# EAGLE design RGB_Station_v11 (EAGLE 7.7.0)
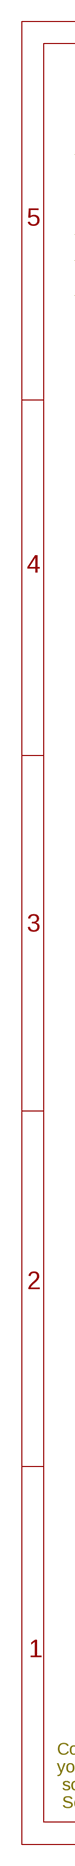
[diagram p0: schematic, sheet 1, part 1 of 2]
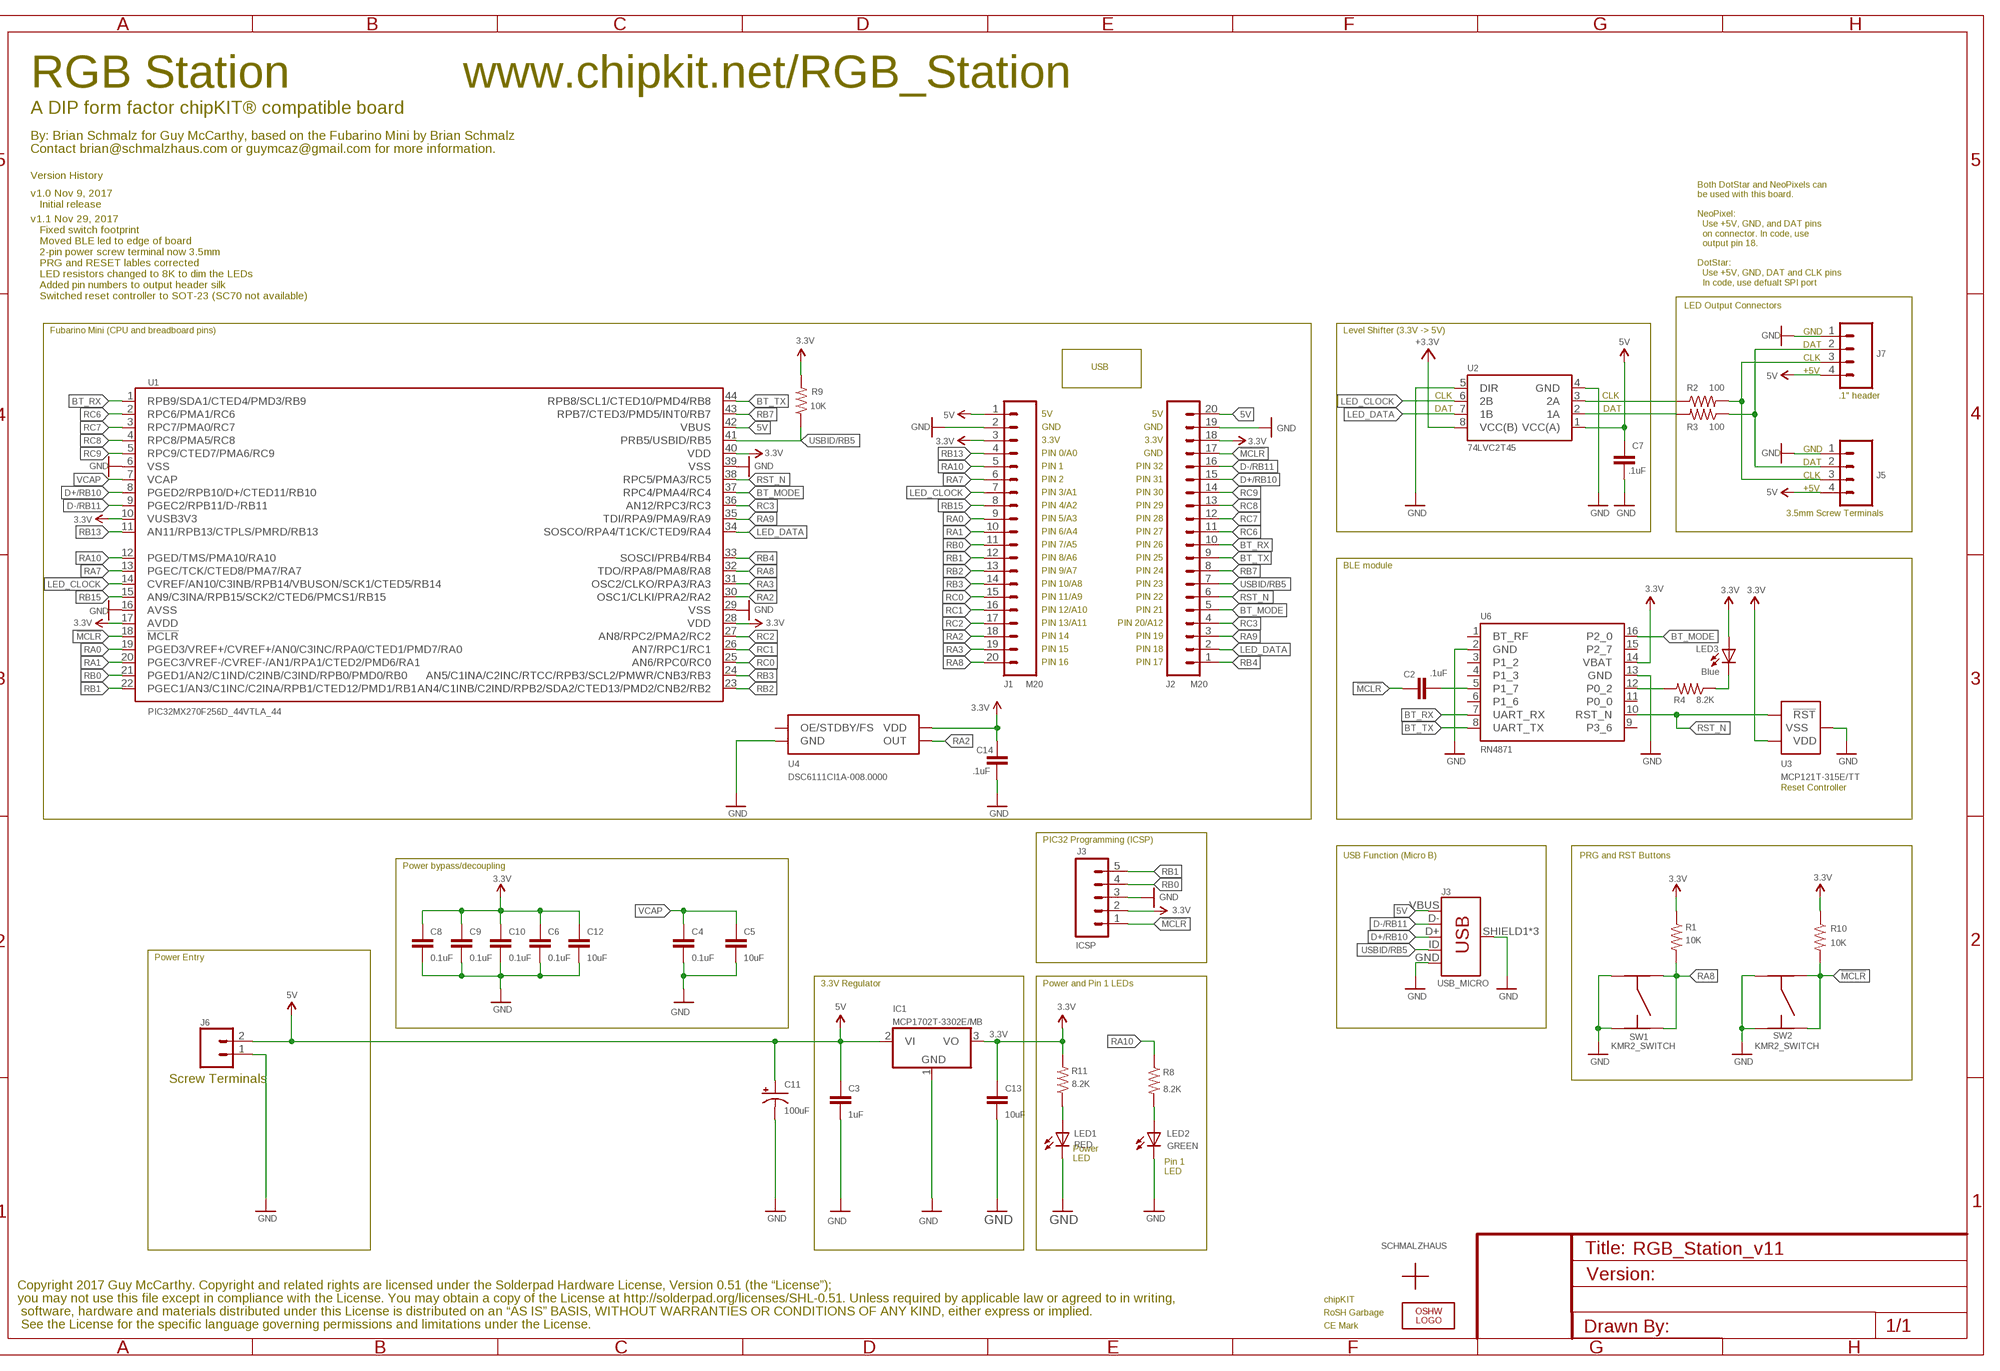
[diagram p1: schematic, sheet 1, part 2 of 2]

## Parts
C2  .1uF  CAP0603-CAP  [0603-CAP]
C3  1uF  CAP0603-CAP  [0603-CAP]
C4  0.1uF  CAP0603-CAP  [0603-CAP]
C5  10uF  CAP0805  [0805]
C6  0.1uF  CAP0603  [0603]
C7  .1uF  CAP0603-CAP  [0603-CAP]
C8  0.1uF  CAP0603-CAP  [0603-CAP]
C9  0.1uF  CAP0603-CAP  [0603-CAP]
C10  0.1uF  CAP0603  [0603]
C11  100uF  CAP_POLC  [PANASONIC_C]
C12  10uF  CAP0805  [0805]
C13  10uF  CAP0805  [0805]
C14  .1uF  CAP0603-CAP  [0603-CAP]
IC1  MCP1702T-3302E/MB  MCP170333MB  [SOT89]
ICSP  J3  M05NOSLILK  [1X05_NOSILK]
J1  M20  [1X20_NO_PIN1]
J2  M20  [1X20_NO_PIN1]
J3  USB_MICRO  USB_MICRO-B_FEMALE-SMT  [USB-B-MICRO-SMD]
J5  CONN_04SCREW  [SCREWTERMINAL-3.5MM-4@1]
J6  CONN_023.5MM  [SCREWTERMINAL-3.5MM-2]
J7  M04PTH  [1X04]
LED1  RED  LED0603  [LED-0603]
LED2  GREEN  LED0603  [LED-0603]
LED3  Blue  LED0603  [LED-0603]
LOGO1  OSHW_LOGO_8MILX0070-NT  [OSHW_8X70_NOTEXT]
R1  10K  RESISTOR0603-RES  [0603-RES]
R2  100  RESISTOR0603  [0603-RES]
R3  100  RESISTOR0603  [0603-RES]
R4  8.2K  RESISTOR0603-RES  [0603-RES]
R8  8.2K  RESISTOR0603-RES  [0603-RES]
R9  10K  RESISTOR0603-RES  [0603-RES]
R10  10K  RESISTOR0603-RES  [0603-RES]
R11  8.2K  RESISTOR0603-RES  [0603-RES]
SW1  KMR2_SWITCH  [KMR2_SWITCH]
SW2  KMR2_SWITCH  [KMR2_SWITCH]
U1  PIC32MX270F256D_44VTLA_44  PIC32MX2XX_44QFN44  [QFN-44-8X8-NOPAD]
U2  74LVC2T45  [VSSOP8]
U3  MCP121T-315E/TT  MCP1X2_RESET_CONTROLLER  [SOT23-3]
U4  DSC6111CI1A-008.0000  DSC61XX  [CDFN-4_3.2X2.5]
U6  RN4871  [RN4871]
U$2  CE_MARK5MM  [CE_5MM]
U$3  ROSH_GARBAGE  [ROHS_GARBAGE_5MM]
U$4  CHIPKIT2MM  [CHIPKIT_2MM]
U$5  SCHMALZHAUSSCHMALZHAUS_SMALL  [SCHMALZHAUS_SMALL]

## Nets
3.3V: C6.1 C8.1 C9.1 C10.1 C12.1 C13.1 C14.2 IC1.3(VO) ICSP.2 J1.3 J2.18 LED3.A R1.1 R9.2 R10.1 R11.2 U1.10(VUSB3V3) U1.17(AVDD) U1.28(VDD) U1.40(VDD) U2.8(VCC(B)) U3.2(VDD) U4.P4(VDD) U6.14(VBAT) ; supply symbol labelled +3.3V
5V: C3.1 C7.2 C11.+ IC1.2(VI) IC1.2@1(VI1) J1.1 J2.20 J3.VBUS J5.4 J6.2 J7.4 U1.42(VBUS) U2.1(VCC(A))
!MCLR!: C2.2 ICSP.1 J2.17 R10.2 SW2.P3 SW2.P4 U1.18(!MCLR!)
BT_MODE: J2.5 U1.37(RPC4/PMA4/RC4) U6.16(P2_0)
BT_RX: J2.10 U1.1(RPB9/SDA1/CTED4/PMD3/RB9) U6.7(UART_RX)
BT_TX: J2.9 U1.44(RPB8/SCL1/CTED10/PMD4/RB8) U6.8(UART_TX)
D+/RB10: J2.15 J3.D+ U1.8(PGED2/RPB10/D+/CTED11/RB10)
D-/RB11: J2.16 J3.D- U1.9(PGEC2/RPB11/D-/RB11)
GND: C3.2 C4.2 C5.2 C6.2 C7.1 C8.2 C9.2 C10.2 C11.- C12.2 C13.2 C14.1 IC1.1(GND) ICSP.3 J1.2 J2.19 J3.GND J3.SHIELD1(SHIELD) J3.SHIELD2(SHIELD) J3.SHIELD3(SHIELD) J5.1 J6.1 J7.1 LED1.C LED2.C SW1.P1 SW1.P2 SW2.P1 SW2.P2 U1.6(VSS) U1.16(AVSS) U1.29(VSS) U1.39(VSS) U2.4(GND) U2.5(DIR) U3.3(VSS) U4.P2(GND) U6.2(GND) U6.13(GND)
LED_CLOCK: J1.7 U1.14(CVREF/AN10/C3INB/RPB14/VBUSON/SCK1/CTED5/RB14) U2.6(2B)
LED_DATA: J2.2 U1.34(SOSCO/RPA4/T1CK/CTED9/RA4) U2.7(1B)
N$1: R4.2 U6.12(P0_2)
N$2: J5.2 J7.2 R3.1
N$3: R3.2 U2.2(1A)
N$4: J5.3 J7.3 R2.2
N$5: LED3.C R4.1
N$6: LED1.A R11.1
N$8: C2.1 U6.5(P1_7)
N$11: LED2.A R8.2
N$23: R2.1 U2.3(2A)
RA0: J1.9 U1.19(PGED3/VREF+/CVREF+/AN0/C3INC/RPA0/CTED1/PMD7/RA0)
RA1: J1.10 U1.20(PGEC3/VREF-/CVREF-/AN1/RPA1/CTED2/PMD6/RA1)
RA2: J1.18 U1.30(OSC1/CLKI/PRA2/RA2) U4.P3(OUT)
RA3: J1.19 U1.31(OSC2/CLKO/RPA3/RA3)
RA7: J1.6 U1.13(PGEC/TCK/CTED8/PMA7/RA7)
RA8: J1.20 R1.2 SW1.P3 SW1.P4 U1.32(TDO/RPA8/PMA8/RA8)
RA9: J2.3 U1.35(TDI/RPA9/PMA9/RA9)
RA10: J1.5 R8.1 U1.12(PGED/TMS/PMA10/RA10)
RB0: ICSP.4 J1.11 U1.21(PGED1/AN2/C1IND/C2INB/C3IND/RPB0/PMD0/RB0)
RB1: ICSP.5 J1.12 U1.22(PGEC1/AN3/C1INC/C2INA/RPB1/CTED12/PMD1/RB1)
RB2: J1.13 U1.23(AN4/C1INB/C2IND/RPB2/SDA2/CTED13/PMD2/CNB2/RB2)
RB3: J1.14 U1.24(AN5/C1INA/C2INC/RTCC/RPB3/SCL2/PMWR/CNB3/RB3)
RB4: J2.1 U1.33(SOSCI/PRB4/RB4)
RB7: J2.8 U1.43(RPB7/CTED3/PMD5/INT0/RB7)
RB13: J1.4 U1.11(AN11/RPB13/CTPLS/PMRD/RB13)
RB15: J1.8 U1.15(AN9/C3INA/RPB15/SCK2/CTED6/PMCS1/RB15)
RC0: J1.15 U1.25(AN6/RPC0/RC0)
RC1: J1.16 U1.26(AN7/RPC1/RC1)
RC2: J1.17 U1.27(AN8/RPC2/PMA2/RC2)
RC3: J2.4 U1.36(AN12/RPC3/RC3)
RC6: J2.11 U1.2(RPC6/PMA1/RC6)
RC7: J2.12 U1.3(RPC7/PMA0/RC7)
RC8: J2.13 U1.4(RPC8/PMA5/RC8)
RC9: J2.14 U1.5(RPC9/CTED7/PMA6/RC9)
RST_N: J2.6 U1.38(RPC5/PMA3/RC5) U3.1(!RST!) U6.10(RST_N)
USBID/RB5: J2.7 J3.ID R9.1 U1.41(PRB5/USBID/RB5)
VCAP: C4.1 C5.1 U1.7(VCAP)
Unconnected: U4.P1(OE/STDBY/FS) U6.1(BT_RF) U6.3(P1_2) U6.4(P1_3) U6.6(P1_6) U6.9(P3_6) U6.11(P0_0) U6.15(P2_7)

## Notes on the sheet
- RGB Station | www.chipkit.net/RGB_Station
- A DIP form factor chipKIT® compatible board
- By: Brian Schmalz for Guy McCarthy, based on the Fubarino Mini by Brian Schmalz
- Contact brian@schmalzhaus.com or guymcaz@gmail.com for more information.
- Version History
- v1.0 Nov 9, 2017
     Initial release
- Both DotStar and NeoPixels can
  be used with this board.
  
  NeoPixel:
    Use +5V, GND, and DAT pins
    on connector. In code, use
    output pin 18.
  
  DotStar:
    Use +5V, GND, DAT and CLK pins
    In code, use defualt SPI port
- v1.1 Nov 29, 2017
     Fixed switch footprint
     Moved BLE led to edge of board
     2-pin power screw terminal now 3.5mm
     PRG and RESET lables corrected
     LED resistors changed to 8K to dim the LEDs
     Added pin numbers to output header silk
     Switched reset controller to SOT-23 (SC70 not available)
- LED Output Connectors
- Fubarino Mini (CPU and breadboard pins) | Level Shifter (3.3V -> 5V) | GND
- DAT
- CLK
- USB
- +5V
- CLK | CLK | .1" header
- 5V | DAT | DAT
- 5V
- GND
- GND
- 3.3V
- 3.3V
- GND | GND
- PIN 0/A0
- PIN 32
- DAT
- PIN 1
- PIN 31
- CLK
- PIN 2
- PIN 30 | +5V
- PIN 3/A1
- PIN 29
- PIN 4/A2
- PIN 28 | 3.5mm Screw Terminals
- PIN 5/A3
- PIN 27
- PIN 6/A4
- PIN 26
- PIN 7/A5
- PIN 25
- PIN 8/A6
- PIN 24 | BLE module
- PIN 9/A7
- PIN 23
- PIN 10/A8
- PIN 22
- PIN 11/A9
- PIN 21
- PIN 12/A10
- PIN 20/A12
- PIN 13/A11
- PIN 19
- PIN 14
- PIN 18
- PIN 15
- PIN 17
- PIN 16
- Reset Controller
- PIC32 Programming (ICSP)
- USB Function (Micro B) | PRG and RST Buttons
- Power bypass/decoupling
- Power Entry
- 3.3V Regulator | Power and Pin 1 LEDs
- Screw Terminals
- Power 
  LED
- Pin 1 
  LED
- Copyright 2017 Guy McCarthy. Copyright and related rights are licensed under the Solderpad Hardware License, Version 0.51 (the “License”);
- you may not use this file except in compliance with the License. You may obtain a copy of the License at http://solderpad.org/licenses/SHL-0.51. Unless required by applicable law or agreed to in writing,
- software, hardware and materials distributed under this License is distributed on an “AS IS” BASIS, WITHOUT WARRANTIES OR CONDITIONS OF ANY KIND, either express or implied.
- See the License for the specific language governing permissions and limitations under the License.

## Library data of the parts
C2 C7 = SparkFun-Capacitors:CAP: Capacitor Standard 0603 ceramic capacitor, and 0.1" leaded capacitor.
C3 C4 C8 C9 C14 = SparkFun:CAP: Capacitor Standard 0603 ceramic capacitor, and 0.1" leaded capacitor.
C5 C12 = SchmalzHaus:CAP: Capacitor Standard 0603 ceramic capacitor, and 0.1" leaded capacitor.
C6 C10 C13 = SparkFun02-20-08:CAP: Capacitor Standard 0603 ceramic capacitor, and 0.1" leaded capacitor.
C11 = SparkFun-Capacitors:CAP_POL: Capacitor Polarized These are standard SMD and PTH capacitors. Normally 10uF, 47uF, and 100uF in electrolytic and tantalum varieties. Always verify the external diameter of the through hole cap, it varies with capacity, voltage, and manufacturer. The EIA devices should be standard.
IC1 = linear:MCP1703*: 250 mA, 16V, Low Quiescent Current LDO Regulator Source: http://ww1.microchip.com/downloads/en/DeviceDoc/22049b.pdf
ICSP = SchmalzHaus:M05: Header 5 Standard 5-pin 0.1" header. Use with straight break away headers (SKU : PRT-00116), right angle break away headers (PRT-00553), swiss pins (PRT-00743), machine pins (PRT-00117), and female headers (PRT-00115). Molex polarized connector foot print use with SKU : PRT-08230 with associated crimp pins and housings.
J1 J2 = SchmalzHaus:M20
J3 = SparkFun-Connectors:USB_MICRO-B: USB Type Micro-B Connector Male/female and PTH/SMT variants SparkFun Products: SparkFun microB USB Breakout <https://www.sparkfun.com/products/12035> SparkFun USB microB Plug Breakout <https://www.sparkfun.com/products/10031> SparkFun ESP8266 Thing <https://www.sparkfun.com/products/13231>; PROD_ID: CONN-11752
J5 = SparkFun-Connectors:CONN_04: Multi connection point. Often used as Generic Header-pin footprint for 0.1 inch spaced/style header connections On any of the 0.1 inch spaced packages, you can populate with these: Break Away Headers - Straight <https://www.sparkfun.com/products/116> (PRT-00116) Break Away Male Headers - Right Angle <https://www.sparkfun.com/products/553> (PRT-00553) Female Headers <https://www.sparkfun.com/products/115> (PRT-00115) Break Away Headers - Machine Pin <https://www.sparkfun.com/products/117> (PRT-00117) Break Away Female Headers - Swiss Machine Pin <https://www.sparkfun.com/products/743> (PRT-00743) For SCREWTERMINALS and SPRING TERMINALS visit here: Screw Terimnals on SparkFun.com <https://www.sparkfun.com/search/results?term=Screw+Terminals> (5mm/3.5mm/2.54mm spacing) This device is also useful as a general connection point to wire up your design to another part of your project. Our various solder wires solder well into these plated through hole pads. Hook-Up Wire - Assortment (Stranded, 22 AWG) <https://www.sparkfun.com/products/11375> (PRT-11375) Hook-Up Wire - Assortment (Solid Core, 22 AWG) <https://www.sparkfun.com/products/11367> (PRT-11367) View the entire wire category on our website here <https://www.sparkfun.com/categories/141> Special notes: Molex polarized connector foot print use with SKU : PRT-08231 with associated crimp pins and housings. 1MM SMD Version SKU: PRT-10208; PROD_ID: 2xCONN-08399; SF_ID: 2xPRT-08084
J6 = SparkFun-Connectors:CONN_02: Multi connection point. Often used as Generic Header-pin footprint for 0.1 inch spaced/style header connections On any of the 0.1 inch spaced packages, you can populate with these: Break Away Headers - Straight <https://www.sparkfun.com/products/116> (PRT-00116) Break Away Male Headers - Right Angle <https://www.sparkfun.com/products/553> (PRT-00553) Female Headers <https://www.sparkfun.com/products/115> (PRT-00115) Break Away Headers - Machine Pin <https://www.sparkfun.com/products/117> (PRT-00117) Break Away Female Headers - Swiss Machine Pin <https://www.sparkfun.com/products/743> (PRT-00743) For SCREWTERMINALS and SPRING TERMINALS visit here: Screw Terimnals on SparkFun.com <https://www.sparkfun.com/search/results?term=Screw+Terminals> (5mm/3.5mm/2.54mm spacing) This device is also useful as a general connection point to wire up your design to another part of your project. Our various solder wires solder well into these plated through hole pads. Hook-Up Wire - Assortment (Stranded, 22 AWG) <https://www.sparkfun.com/products/11375> (PRT-11375) Hook-Up Wire - Assortment (Solid Core, 22 AWG) <https://www.sparkfun.com/products/11367> (PRT-11367) View the entire wire category on our website here <https://www.sparkfun.com/categories/141> Special notes: Molex polarized connector foot print use with: PRT-08233 with associated crimp pins and housings. 2.54_SCREWTERM for use with PRT-10571. 3.5mm Screw Terminal footprints for PRT-08084 5mm Screw Terminal footprints for use with PRT-08432; PROD_ID: CONN-08399
J7 = SparkFun-Connectors:M04: Header 4 Standard 4-pin 0.1" header. Use with straight break away headers (SKU : PRT-00116), right angle break away headers (PRT-00553), swiss pins (PRT-00743), machine pins (PRT-00117), and female headers (PRT-00115). Molex polarized connector foot print use with SKU : PRT-08231 with associated crimp pins and housings. 1MM SMD Version SKU: PRT-10208; PROD_ID: CONN-09696
LED1-LED3 = SparkFun:LED: LEDs Standard schematic elements and footprints for 5mm, 3mm, 1206, and 0603 sized LEDs. 5mm - Spark Fun Electronics SKU : COM-00529 (and others)
LOGO1 = OSHW:OSHW_LOGO_8MIL
R1 R4 R8-R11 = SparkFun:RESISTOR: Resistor Basic schematic elements and footprints for 0603, 1206, and PTH resistors.
R2 R3 = SparkFun-Resistors:RESISTOR: Resistor Basic schematic elements and footprints for 0603, 1206, and PTH resistors.
SW1 SW2 = kmr2_switch:KMR2_SWITCH
U1 = SchmalzHaus:PIC32MX2XX_44
U2 = 74LVCH2T45DC:74LVC2T45
U3 = MCP1x2_ResetController:MCP1X2_RESET_CONTROLLER
U4 = DSC61XX:DSC61XX
U6 = RN4870-71:RN4871
U$2 = SchmalzHausPublic:CE_MARK
U$3 = SchmalzHausPublic:ROSH_GARBAGE
U$4 = SchmalzHausPublic:CHIPKIT
U$5 = SchmalzHaus:SCHMALZHAUS

## Board
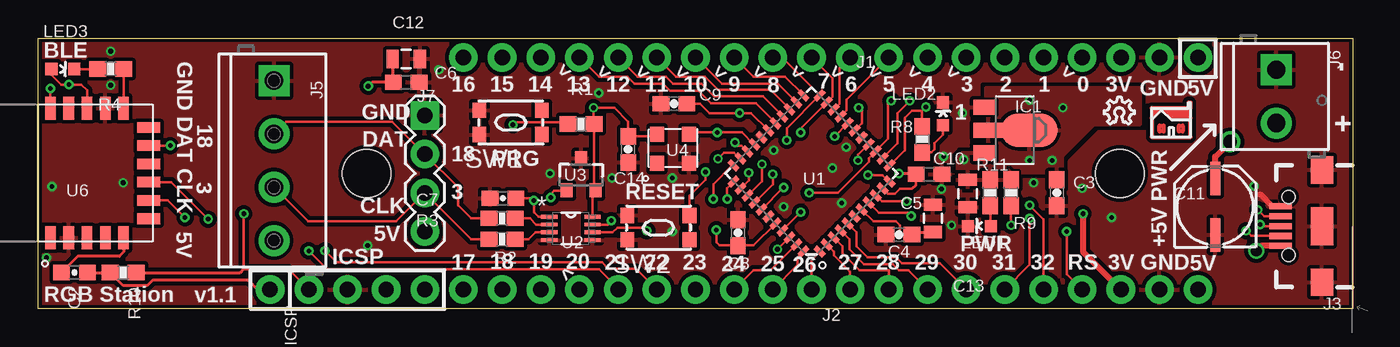
[diagram p2: board, top side]
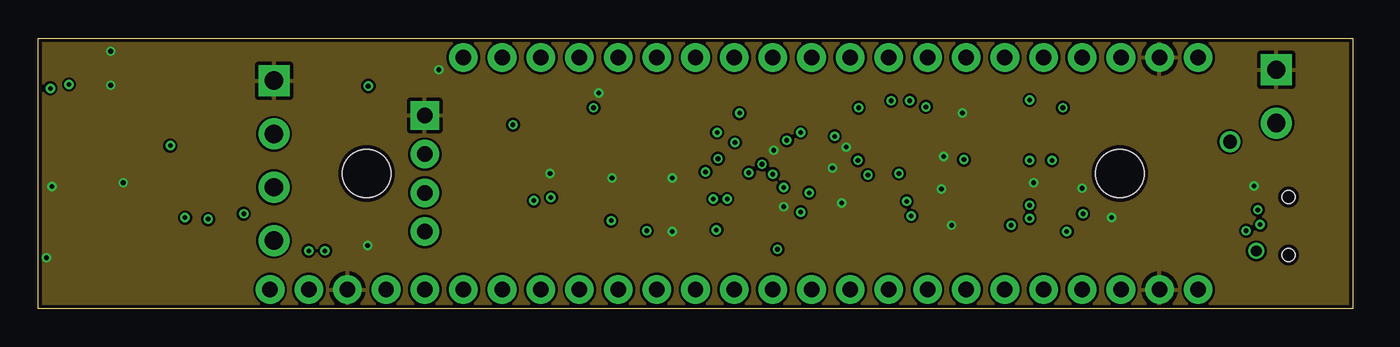
[diagram p3: board, inner layer Route2]
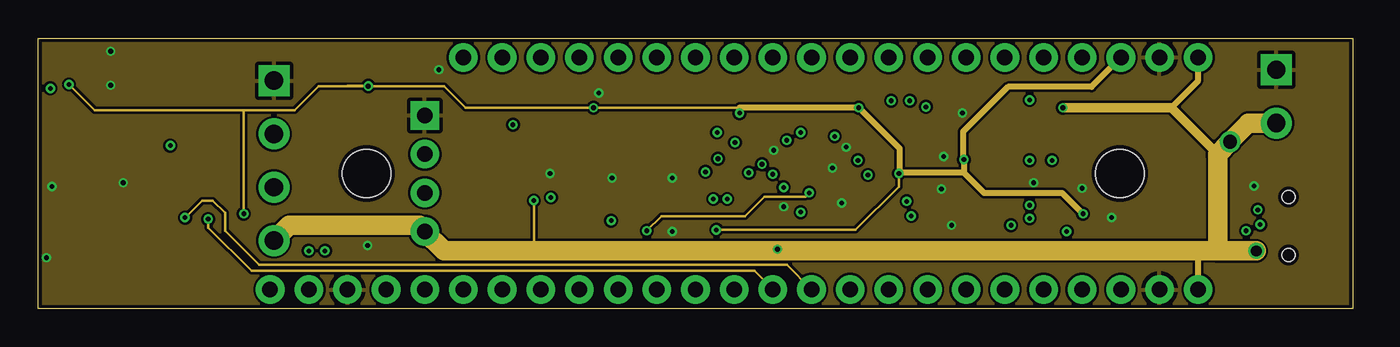
[diagram p4: board, inner layer Route15]
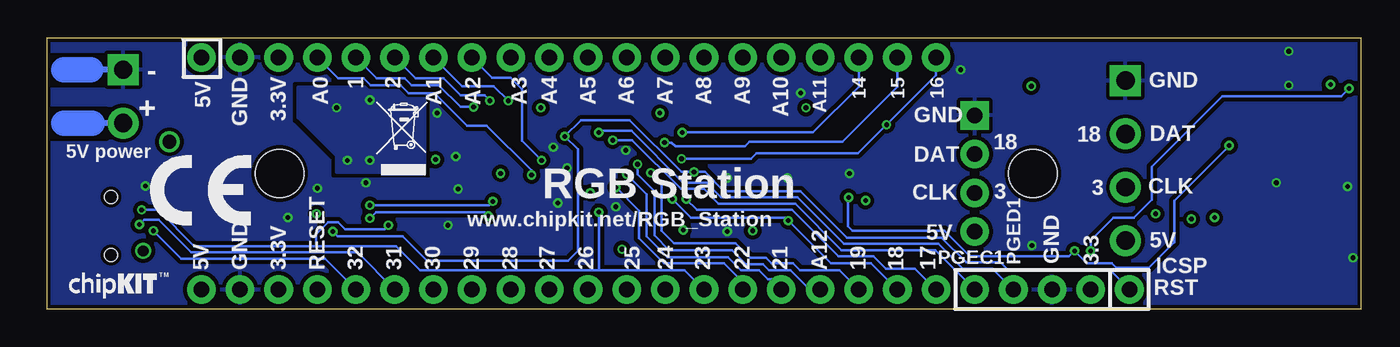
[diagram p5: board, bottom side, seen from below]

Size 86.36 x 17.78 mm. Coordinates in mm from the lower left corner, seen from the top.
Outline: 0,17.78 86.36,17.78 86.36,0 0,0 0,17.78
Copper layers (1*2*15*16): Top 0.035mm / dielectric 1.5mm / Route2 0.035mm / dielectric 0.15mm / Route15 0.035mm / dielectric 0.2mm / Bottom 0.035mm
Design rules "Fusion_eagle_rule_v1.1 *": minimum track width 6mil, minimum drill 12mil, track to track 6mil, track to pad 6mil, pad to pad 6mil, via to via 6mil, smd to smd 0mil, copper to edge 10mil, drill to drill 10mil, minimum pad ring 10mil, minimum via ring 6mil, stop-mask expansion 2mil, vias tented up to drill 100mil, thermal gap 10mil
Holes 3.17 mm at 21.59,8.89 71.04,8.89
bRestrict: area 82.4,11.3 to 86.4,13.1; area 82.5,14.8 to 86.5,16.6

### Footprints (pad centres in the part's own frame; a part is rotated, then mirrored left to right if it is on the bottom)
0603-CAP = smd 1.1 x 1: 1 -0.85,0; 2 0.85,0
0805 = smd 0.8 x 1.2: 1 -0.9,0; 2 0.9,0
0603 = smd 1.1 x 1: 1 -0.85,0; 2 0.85,0
PANASONIC_C = smd 2.2 x 0.65: + 1.9,-0.2; - -1.8,-0.2
SOT89 = smd 1 x 1.5: 1 -1.499,-1.981; 3 1.499,-1.981 | smd 1 x 2: 2 0,-1.727 | smd 2.2 x 3.7: 2@1 0,0.94
1X05_NOSILK = drill 1.016 pad 1.88: 1 0,0; 2 2.54,0; 3 5.08,0; 4 7.62,0; 5 10.16,0
1X20_NO_PIN1 = drill 1.016 pad 1.88: 1 -24.13,0; 2 -21.59,0; 3 -19.05,0; 4 -16.51,0; 5 -13.97,0; 6 -11.43,0; 7 -8.89,0; 8 -6.35,0; 9 -3.81,0; 10 -1.27,0; 11 1.27,0; 12 3.81,0; 13 6.35,0; 14 8.89,0; 15 11.43,0; 16 13.97,0; 17 16.51,0; 18 19.05,0; 19 21.59,0; 20 24.13,0
USB-B-MICRO-SMD = smd 1.45 x 0.4: D+ 2.725,0; D- 2.725,0.65; GND 2.725,-1.3; ID 2.725,-0.65; VBUS 2.725,1.3 | smd 1.5 x 1.8: SHIELD1 0,3.685; SHIELD2 0,-3.685 | smd 1.5 x 2.5: SHIELD3 0,0 | hole 0.85: 2.2,1.9; 2.2,-1.9
SCREWTERMINAL-3.5MM-4@1 = drill 1.2 pad 2.032 square: 1 0,0 | drill 1.2 pad 2.032: 2 3.5,0; 3 7,0; 4 10.5,0
SCREWTERMINAL-3.5MM-2 = drill 1.2 pad 2.032 square: 1 0,0 | drill 1.2 pad 2.032: 2 3.5,0
1X04 = drill 1.016 pad 1.88 square: 1 0,0 | drill 1.016 pad 1.88: 2 2.54,0; 3 5.08,0; 4 7.62,0
LED-0603 = smd 0.8 x 0.8: A 0,-0.75; C 0,0.75
0603-RES = smd 1.1 x 1: 1 -0.85,0; 2 0.85,0
KMR2_SWITCH = smd 0.9 x 1: P1 -2.05,0.8; P2 -2.05,-0.8; P3 2.05,-0.8; P4 2.05,0.8
QFN-44-8X8-NOPAD = smd 0.8 x 0.35: 1 -4,3.25; 2 -4,2.6; 3 -4,1.95; 4 -4,1.3; 5 -4,0.65; 6 -4,0; 7 -4,-0.65; 8 -4,-1.3; 9 -4,-1.95; 10 -4,-2.6; 11 -4,-3.25; 23 4,-3.25; 24 4,-2.6; 25 4,-1.95; 26 4,-1.3; 27 4,-0.65; 28 4,0; 29 4,0.65; 30 4,1.3; 31 4,1.95; 32 4,2.6; 33 4,3.25 | smd 0.35 x 0.8: 12 -3.25,-4; 13 -2.6,-4; 14 -1.95,-4; 15 -1.3,-4; 16 -0.65,-4; 17 0,-4; 18 0.65,-4; 19 1.3,-4; 20 1.95,-4; 21 2.6,-4; 22 3.25,-4; 34 3.25,4; 35 2.6,4; 36 1.95,4; 37 1.3,4; 38 0.65,4; 39 0,4; 40 -0.65,4; 41 -1.3,4; 42 -1.95,4; 43 -2.6,4; 44 -3.25,4
VSSOP8 = smd 1.067 x 0.254: 1 -1.422,0.762; 2 -1.422,0.254; 3 -1.422,-0.254; 4 -1.422,-0.762; 5 1.422,-0.762; 6 1.422,-0.254; 7 1.422,0.254; 8 1.422,0.762
SOT23-3 = smd 0.8 x 0.9: 1 -0.95,-1; 2 0.95,-1; 3 0,1.1
CDFN-4_3.2X2.5 = smd 1 x 0.9: P1 -0.95,1.05; P2 -0.95,-1.05; P3 0.95,-1.05; P4 0.95,1.05
RN4871 = smd 1.5 x 0.7: 1 0.25,6.7; 2 0.25,5.5; 3 0.25,4.3; 4 0.25,3.1; 5 0.25,1.9; 12 8.75,1.9; 13 8.75,3.1; 14 8.75,4.3; 15 8.75,5.5; 16 8.75,6.7 | smd 0.7 x 1.5: 6 1.5,0.25; 7 2.7,0.25; 8 3.9,0.25; 9 5.1,0.25; 10 6.3,0.25; 11 7.5,0.25

### Placement (x,y rotation side)
C2  2.39,2.39 0 top
C3  66.9,7.62 270 top
C4  56.54,4.88 180 top
C5  58.78,5.94 90 top
C6  24.18,14.88 0 top
C7  30.53,7.26 0 top
C8  45.97,5 90 top
C9  41.76,13.46 180 top
C10  58.52,8.84 0 top
C11  77.11,6.65 90 top
C12  24.18,16.41 0 top
C13  61.06,7.57 270 top
C14  38.76,10.46 90 top
IC1  64.16,11.73 270 top
ICSP  15.24,1.27 0 top
J1  52.07,16.51 180 top
J2  52.07,1.27 0 top
J3  84.33,5.44 180 top
J5  15.49,14.99 270 top
J6  81.33,15.7 270 top
J7  25.4,12.7 270 top
LED1  61.82,5.44 90 top
LED2  59.44,12.8 0 top
LED3  1.63,15.75 270 top
LOGO1  70.03,12.14 0 top
R1  35.66,12.14 180 top
R2  30.48,4.57 180 top
R3  30.48,5.94 0 top
R4  4.78,15.75 0 top
R8  58.06,11.13 270 top
R9  63.91,7.62 90 top
R10  5.59,2.39 180 top
R11  62.53,7.62 90 top
SW1  31.04,12.24 0 top
SW2  40.74,5.33 0 top
U1  50.8,8.89 135 top
U2  35,5.28 0 top
U3  35.66,8.79 0 top
U4  41.71,10.52 90 top
U6  7.52,4.42 90 top
U$2  76.23,7.83 0 bottom
U$3  64.67,8.78 0 bottom
U$4  84.99,0.65 0 bottom
U$5  74.42,11.28 0 top

### Tracks (layer width: path | path; a pad name or v marks a point on that pad's centre or on a via)
3.3V  (via drill 0.3, 0.33)
  Top 0.178: 55.5,7.9 55.83,7.57 56.29,7.57 56.59,7.87 57.4,7.87 57.66,8.13 57.66,8.83 C10.1 | U1.28 46.84,12.85 v46.08,12.85 44.09,12.85 43.48,13.46 C9.1 | U1.17 54.1,12.19 54.1,13.01 v53.9,13.21 | U1.40 46.99,4.17 45.98,4.17 | 45.98,4.17 C8.1 | 45.98,4.17 44.76,4.17 44.55,4.37 v44.55,5.18 | ICSP.2 16.46,2.59 13.56,2.59 13.51,2.64 v13.51,6.25 | U2.8 36.42,7.52 36.52,7.52 36.61,7.61 U3.2 36.52,7.88 36.52,12.13 R1.1 36.48,12.17 v36.48,13.21 37.85,13.21 38.76,12.29 C14.2 38.95,11.31 38.96,11.33 40.52,11.33 U4.P4 | U6.14 3.22,14.36 2.85,14.73 v2.03,14.73 1.52,14.73 0.88,15.38 LED3.A
  Top 0.203: U1.10 55.5,7.9 | U1.40 | v56.54,8.89 57.62,8.89 C10.1 | R10.1 13.26,2.39 13.51,2.64 | C12.1 23.28,14.93 C6.1 21.95,14.88 v21.69,14.63
  Top 0.406: v68.63,6.25 68.63,3.76 J2.18
  Route15 0.178: 46.08,13.21 v36.48,13.21 28.09,13.21 26.67,14.63 v21.69,14.63 | 20.32,14.63 18.44,14.63 16.87,13.06 13.5,13.06 | 13.5,13.06 3.71,13.06 v2.03,14.73 | 13.5,13.06 13.5,6.26 v13.51,6.25 | v44.55,5.18 53.7,5.18 56.54,8.03 v56.54,8.89
  Route15 0.203: v21.69,14.63 20.32,14.63
  Route15 0.406: J1.3 69.19,14.58 63.7,14.58 60.76,11.63 60.76,9.86 v60.81,9.8 60.81,8.94 | 60.81,8.94 62.13,7.62 67.26,7.62 v68.63,6.25 | 60.81,8.94 56.59,8.94 | 56.59,8.94 v56.54,8.89 | 56.59,8.94 56.59,10.52 v53.9,13.21 46.08,13.21 v46.08,12.85
  pour Top: 60.71,10.26 60.35,9.91 60.35,7.98 63.96,7.98 63.96,8.94 63.6,9.3 62.79,9.3 62.53,9.55 62.53,9.86 62.13,10.26
5V  (via drill 0.3, 0.7, 0.9)
  Top 0.178: C7.2 32.41,7.26 v32.56,7.11 32.56,6.35 32.87,6.04 U2.1 | 49.35,4.7 v48.56,3.91
  Top 0.203: U1.42 49.35,4.7
  Top 0.406: C11.+ 77.31,10 v78.28,10.97 | J3.VBUS 80.34,4.14 v80.01,3.81
  Route15 0.178: v32.56,7.11 32.56,3.86 32.51,3.81 | v48.56,3.91 48.56,3.81
  Route15 0.254: 79.5,12.19 79.51,12.19
  Route15 0.406: 74.42,13.21 76.2,14.99 J1.1 | J2.20 76.2,3.81 | 77.47,10.06 77.47,10.16
  Route15 0.61: 77.47,10.16 74.42,13.21 v67.31,13.21
  Route15 1.27: 77.47,10.06 77.47,3.81 | 77.47,3.81 76.2,3.81 48.56,3.81 32.51,3.81 26.67,3.81 J7.4 25.4,5.13 25.04,5.49 16.49,5.49 J5.4 | 77.47,3.81 v80.01,3.81 | 77.47,10.16 v78.28,10.97 79.5,12.19 79.51,12.2 J6.2
  Bottom 0.406: J6.2 83.36,12.19
  Bottom 1.676: 83.36,12.19 85.24,12.19
  other vias: 66.6,9.75 65.13,13.72 65.13,9.75
  pour Top (rank 3): 62.28,8.94 67.31,8.94 67.31,10.01 69.39,12.09 72.39,12.09 72.44,12.14 72.44,14.53 62.23,14.53
  pour Bottom: 61.52,14.58 61.52,8.89 67.31,8.94 67.31,10.01 69.85,12.55 69.85,14.58
!MCLR!  (via drill 0.3)
  Top 0.178: v52.32,11.33 U1.18 | v67.56,5.08 67.56,2.29 J2.17 | v43.84,8.99 43.84,8.48 42.79,7.43 SW2.P4 SW2.P3
  Top 0.203: v52.32,11.33 | C2.2 R10.2 5.6,1.52 7.16,1.52 7.52,1.88 13.82,1.88 14.43,1.27 ICSP.1
  Bottom 0.178: v67.56,5.08 67.26,4.78 62.99,4.78 61.37,3.15 52.12,3.15 51.46,3.81 51.46,10.46 v52.32,11.33 51.26,12.39 48.06,12.39 44.65,8.99 v43.84,8.99 43.13,8.99 41.86,7.72 36.83,7.72 33.78,4.67 27.58,4.67 25.96,3.05 23.72,3.05 23.27,2.59 16.56,2.59 ICSP.1
BT_MODE  (via drill 0.3)
  Top 0.178: v48.26,8.84 48.26,8.18 47.06,6.98 | J2.5 38.1,1.32 36.83,2.59 19,2.59 v17.78,3.81 | v0.81,14.48 U6.16
  Top 0.203: U1.37 47.06,6.98
  Bottom 0.178: J2.5 38.76,1.93 38.96,1.93 39.57,2.54 40.74,2.54 41.6,3.4 45.57,3.4 46.94,4.78 46.94,7.52 v48.26,8.84 | v17.78,3.81 17.78,4.52 16.31,5.99 14.94,5.99 13.77,7.16 13.77,9.35 9.14,13.97 1.32,13.97 v0.81,14.48
BT_RX  (via drill 0.3)
  Top 0.178: 51.35,3.75 51.33,3.73 | 51.33,3.73 50.8,3.2 J2.10 | U6.7 8.53,7.12 v9.65,5.99 | U1.1 51.33,3.73
  Top 0.203: 51.35,3.76 51.35,3.75
  Route15 0.178: J2.10 49.17,2.9 14.53,2.9 12.29,5.13 12.29,6.3 11.48,7.11 10.77,7.11 v9.65,5.99
BT_TX  (via drill 0.3)
  Top 0.178: 50.16,3.68 49.89,3.4 49.89,2.9 J2.9 | U6.8 8.75,8.32 v11.18,5.89 | 50.27,3.68 U1.44
  Top 0.203: 50.27,3.68 50.16,3.68
  Route15 0.178: J2.9 47.04,2.49 14.02,2.49 11.18,5.33 v11.18,5.89
D+/RB10  (via drill 0.3)
  Top 0.178: U1.8 55.22,6.3 57.15,6.3 v57.35,6.1 | J3.D+ 80.37,5.44 v80.26,5.54 | v65.13,5.94 65.13,2.9 J2.15
  Top 0.203: U1.8
  Bottom 0.178: v57.35,6.1 57.61,6.35 64.72,6.35 v65.13,5.94 | v80.26,5.54 79.96,5.84 78.99,5.84 76.86,3.71 65.94,3.71 J2.15
D-/RB11  (via drill 0.3)
  Top 0.178: 55.04,7.44 55.42,7.06 v57.05,7.06 | J3.D- 79.69,4.79 v79.35,5.13 | v65.13,6.81 66.04,5.89 J2.16
  Top 0.203: U1.9 55.04,7.44
  Bottom 0.178: v57.05,7.06 57.3,6.81 v65.13,6.81 | v79.35,5.13 77.52,3.3 68.07,3.3 J2.16
GND  (via drill 0.3)
  Top 0.178: J3.GND 81.05,6.74
  Top 0.406: 81.05,6.74 80.26,7.52
  Bottom 0.406: J6.1 83.46,15.7
  Bottom 1.676: 83.46,15.7 85.24,15.7
  other vias: 52.78,6.96 53.09,10.62 48.97,6.71 48.31,10.41 59.33,7.87 59.99,5.49 70.51,5.99 79.86,8.08 68.58,7.92 65.38,8.28 60.71,12.85 59.49,10.01 5.59,8.28 4.78,14.68 4.78,16.92 0.56,3.35 0.91,8.03 36.83,14.17 41.66,5.08 33.63,8.89 52.17,9.25 21.64,4.17 37.69,8.59 41.66,8.59 26.31,15.7
  pour Top (isolate 0.254, rank 6): 0,17.78 0,0 86.36,0 86.36,17.78
  pour Route2: 0,17.78 86.36,17.78 86.36,0 0,0
  pour Route15: 0,17.78 86.36,17.78 86.36,0 0,0
  pour Bottom (isolate 0.254, rank 3): 0,0 0,17.78 86.36,17.78 86.36,0
LED_CLOCK  (via drill 0.3)
  Top 0.178: v56.03,13.66 55.83,13.46 55.83,11.18 55.01,10.35 U1.14 54.99,10.34 54.56,9.91 54.56,9.65 52.53,7.62 v50.65,7.62 | U2.6 37.74,5.03 38.05,5.33 39.78,5.33 v39.98,5.13
  Route15 0.178: v50.65,7.62 50.39,7.37 47.7,7.37 46.43,6.1 40.95,6.1 v39.98,5.13
  Bottom 0.178: v56.03,13.66 57,14.63 59.08,14.63 J1.7
LED_DATA  (via drill 0.3)
  Top 0.178: 45.67,8.34 45.26,7.92 v45.26,7.21 | U2.7 37.39,5.54 v37.64,5.79
  Top 0.203: U1.34 45.67,8.34
  Bottom 0.178: J2.2 32.21,3 34.85,3 v37.64,5.79 37.85,5.99 44.04,5.99 v45.26,7.21
N$1
  Top 0.178: U6.12 5.62,15.74 R4.2
N$2
  Top 0.178: R3.1 28.45,5.94 27.58,6.81 27.58,7.98 J7.2 23.27,12.29 16.3,12.29 J5.2
N$3
  Top 0.178: U2.2 32.72,5.54 32.31,5.94 R3.2
N$4
  Top 0.178: R2.2 28.45,4.57 J7.3 23.52,5.74 17.74,5.74 J5.3
N$5
  Top 0.178: LED3.C R4.1
N$6
  Top 0.178: R11.1 62.53,5.47
  Top 0.203: 62.53,5.47 LED1.A
N$8
  Top 0.178: U6.5
  Top 0.203: U6.5 5.62,3.74 5.33,3.45 2.6,3.45 C2.1
N$11
  Top 0.178: R8.2 58.69,10.28 58.88,10.46 58.88,10.87 59.44,11.43 LED2.A
N$23
  Top 0.178: U2.3 32.66,5.03 32.21,4.57 R2.1
RA0
  Top 0.178: 52.71,12.68 53.09,13.06 53.09,13.72 J1.9
  Top 0.203: U1.19 52.71,12.68
RA1
  Top 0.178: 52.26,13.1 52.63,13.46 52.63,15.8 J1.10
  Top 0.203: U1.20 52.26,13.1
RA2  (via drill 0.3)
  Top 0.178: 47,10.81 46.23,11.58 v44.6,11.58 42.87,11.58 U4.P3
  Top 0.203: U1.30 47,10.81
  Bottom 0.178: v44.6,11.58 36.02,11.58 33.02,14.58 J1.18
RA3  (via drill 0.3)
  Top 0.178: U1.31 46.21,10.72 45.97,10.72 v45.77,10.92
  Bottom 0.178: J1.19 30.48,14.58 34.09,10.97 40.18,10.97 40.49,10.67 45.06,10.67 45.31,10.92 v45.77,10.92
RA7  (via drill 0.3)
  Top 0.178: 55.47,9.9 56.44,10.87 56.44,12.85 v57.25,13.66
  Top 0.203: U1.13 55.47,9.9
  Bottom 0.178: v57.25,13.66 57.61,14.02 59.18,14.02 60.3,15.14 62.13,15.14 J1.6
RA8  (via drill 0.3)
  Top 0.178: 46.1,9.88 45.72,10.26 45.06,10.26 v44.65,9.86 | v31.19,12.09 31.34,12.24 33.17,12.24 | 33.17,12.24 34.71,12.24 R1.2 | SW1.P4 33.09,12.33 33.17,12.24 | SW1.P3 33.09,12.16 33.17,12.24
  Top 0.203: U1.32 46.1,9.88
  Bottom 0.178: v44.65,9.86 40.08,9.86 39.73,10.21 33.07,10.21 v31.19,12.09 27.94,15.34 J1.20
RA9  (via drill 0.3)
  Top 0.178: 46.15,7.9 46.69,8.43 v46.69,8.94
  Top 0.203: U1.35 46.15,7.9
  Bottom 0.178: J2.3 34.29,2.54 36.88,2.54 37.34,3 38.76,3 39.12,3.35 40.13,3.35 41.1,4.32 45.16,4.32 45.97,5.13 45.97,8.23 v46.69,8.94
RA10  (via drill 0.3)
  Top 0.178: 55.95,9.42 56.95,10.41 56.95,12.55 57.4,13.01 58.06,13.01 | R8.1 58.06,13.01 | 58.06,13.01 v58.32,13.26
  Top 0.203: U1.12 55.95,9.42
  Bottom 0.178: v58.32,13.26 59.18,13.26 60.6,14.68 62.38,14.68 62.84,15.14 64.67,15.14 J1.5
RB0  (via drill 0.3)
  Top 0.178: 51.81,13.56 52.17,13.92 52.17,15.14 J1.11 | 51.79,13.54 50.09,11.84 v50.09,11.58
  Top 0.203: 51.81,13.56 U1.21 51.79,13.54
  Bottom 0.178: v50.09,11.58 49.99,11.68 47.95,11.68 44.55,8.28 43.03,8.28 42.06,7.32 37.03,7.32 33.98,4.27 27.79,4.27 26.16,2.64 24.23,2.64 ICSP.4
RB1  (via drill 0.3)
  Top 0.178: v49.17,11.07 49.17,11.86 U1.22 | 51.33,14.05 48.87,16.51
  Top 0.203: U1.22 51.33,14.05 | 48.87,16.51 J1.12
  Bottom 0.178: v49.17,11.07 47.9,11.07 44.7,7.87 43.18,7.87 42.22,6.91 37.19,6.91 34.14,3.86 27.99,3.86 ICSP.5
RB2
  Top 0.178: 50.27,14.04 49.07,15.24 46.99,15.24 J1.13
  Top 0.203: U1.23 50.27,14.04
RB3
  Top 0.178: J1.14 44.91,14.78 48.58,14.78 U1.24
RB4  (via drill 0.3)
  Top 0.178: 45.59,9.42 44.35,8.18 v44.35,7.21
  Top 0.203: U1.33 45.59,9.42
  Bottom 0.178: J2.1 29.31,2.64 31.24,2.64 32.05,3.45 34.34,3.45 37.39,6.5 43.64,6.5 v44.35,7.21
RB7
  Top 0.178: 49.76,4.19 48.11,2.54 46.99,2.54 J2.8
  Top 0.203: U1.43 49.81,4.19 49.76,4.19
RB13  (via drill 0.3)
  Top 0.178: 55.9,8.36 55.47,8.79 v54.51,8.79
  Top 0.203: U1.11 55.9,8.36
  Bottom 0.178: J1.4 67.21,15.14 65.53,15.14 65.08,14.68 63.09,14.68 62.59,14.17 60.86,14.17 58.73,12.04 57.45,12.04 54.51,9.09 v54.51,8.79
RB15  (via drill 0.3)
  Top 0.178: v53.85,9.75 53.85,10.11 54.54,10.8 U1.15
  Bottom 0.178: v53.85,9.75 55.12,11.02 55.12,14.43 55.88,15.19 57.1,15.19 J1.8
RC0
  Top 0.178: J1.15 41.91,15.24 43.79,15.24 44.65,14.38 48.11,14.38 49.35,13.13
  Top 0.203: U1.25 49.35,13.13
RC1
  Top 0.178: J1.16 39.37,15.24 41.25,15.24 41.71,14.78 43.59,14.78 44.4,13.97 47.6,13.97 48.89,12.68
  Top 0.203: U1.26 48.89,12.68
RC2
  Top 0.178: J1.17 36.83,15.24 38.71,15.24 39.17,14.78 41.05,14.78 41.5,14.33 43.38,14.33 44.2,13.51 47.14,13.51 48.43,12.22
  Top 0.203: U1.27 48.43,12.22
RC3  (via drill 0.3)
  Top 0.178: v47.55,9.5 47.55,8.38 46.61,7.44
  Top 0.203: U1.36 46.61,7.44
  Bottom 0.178: J2.4 36.22,1.27 37.49,2.54 38.91,2.54 39.32,2.95 40.44,2.95 41.35,3.86 45.47,3.86 46.43,4.83 46.43,7.72 47.55,8.84 v47.55,9.5
RC6
  Top 0.178: 51.81,4.22 52.27,3.76 52.27,3.5 53.34,2.44 J2.11
  Top 0.203: U1.2 51.81,4.22
RC7
  Top 0.178: J2.12 55.88,2.54 53.95,2.54 52.83,3.66 52.83,4.12 52.26,4.68
  Top 0.203: U1.3 52.26,4.68
RC8
  Top 0.178: J2.13 57.15,2.54 56.54,2.54 56.13,2.95 54.25,2.95 53.29,3.91 53.29,4.57 U1.4
  Top 0.203: U1.4
RC9
  Top 0.178: J2.14 59.23,3 56.74,3 56.34,3.4 54.46,3.4 53.75,4.12 53.75,5.03 U1.5
  Top 0.203: U1.5
RST_N  (via drill 0.3)
  Top 0.178: U1.38 v48.97,7.98 | J2.6 39.27,2.64 37.44,2.64 37.03,3.05 19.61,3.05 v18.85,3.81 | v8.69,10.72 U6.10 | v33.68,7.32 33.68,7.57 33.88,7.77 34.7,7.77 U3.1
  Top 0.203: U1.38
  Bottom 0.178: v48.97,7.98 47.45,6.45 47.45,4.62 45.82,3 41.86,3 40.64,1.78 J2.6 | v8.69,10.72 12.29,7.11 12.29,4.37 13.97,2.69 16.1,2.69 16.41,3 18.03,3 v18.85,3.81 19.2,3.45 25.7,3.45 27.38,5.13 33.43,5.13 33.73,5.44 33.73,7.26 v33.68,7.32
USBID/RB5  (via drill 0.3)
  Top 0.178: 48.89,5.15 v50.09,6.35 | J3.ID 80.53,6.09 v80.11,6.5 | v63.91,5.49 R9.1
  Top 0.203: U1.41 48.89,5.15
  Bottom 0.178: J2.7 44.45,2.54 50.09,2.54 | 50.09,2.54 61.82,2.54 63.4,4.12 68.66,4.12 | 68.66,4.12 76.66,4.12 79.05,6.5 v80.11,6.5 | v50.09,6.35 50.09,2.54 | 68.66,4.12 68.66,4.9 67.87,5.69 67.21,5.69 66.75,5.23 64.16,5.23 v63.91,5.49
VCAP
  Top 0.178: U1.7 54.86,5.74 56.34,5.74 56.59,5.49 56.59,5.08 56.74,4.93 57.19,4.93
  Top 0.203: U1.7 | 56.9,4.94 57.2,4.94 | 57.33,4.94 57.77,4.94 57.86,5.03 58.76,5.03 C5.1 | 57.19,4.93 57.2,4.94 | 57.2,4.94 57.33,4.94 | 57.33,4.94 C4.1

### Text on the board
tPlace: BLE | GND | ^ | ^ | ^ | ^ | ^ | ^ | ^ | ^ | ^ | ^ | ^ | ^ | - | 16 | 15 | 14 | 13 | 12 | 11 | 10 | 9 | 8 | 7 | 6 | 5 | 4 | 3 | 2 | 1 | 0 | 3V | GND | 5V | DAT | 18 | GND | 1 | DAT | + | 18 | CLK | PRG | 3 | 3 | RESET | CLK | 5V | 5V | PWR | +5V PWR | ICSP | 17 | 18 | 19 | 20 | 21 | 22 | 23 | 27 | 28 | 29 | 30 | 31 | 32 | RS | 3V | GND | ^ | 24 | 25 | 26 | 5V | RGB Station | v1.1
bPlace: GND | 16 | 15 | 14 | A11 | A10 | A9 | A8 | A7 | A6 | A5 | A4 | A3 | A2 | A1 | 2 | 1 | A0 | 3.3V | GND | 5V | - | GND | + | DAT | 18 | 5V power | 18 | DAT | CLK | 3 | 3 | CLK | RGB Station | www.chipkit.net/RGB_Station | 5V | PGEC1 | 5V | 3.3 | GND | PGED1 | 17 | 18 | 19 | A12 | 21 | 22 | 23 | 24 | 25 | 26 | 27 | 28 | 29 | 30 | 31 | 32 | RESET | 3.3V | GND | 5V | RST | ICSP